# Altium schematic sheet v1.0.SchDoc
size 109 x 76 mm
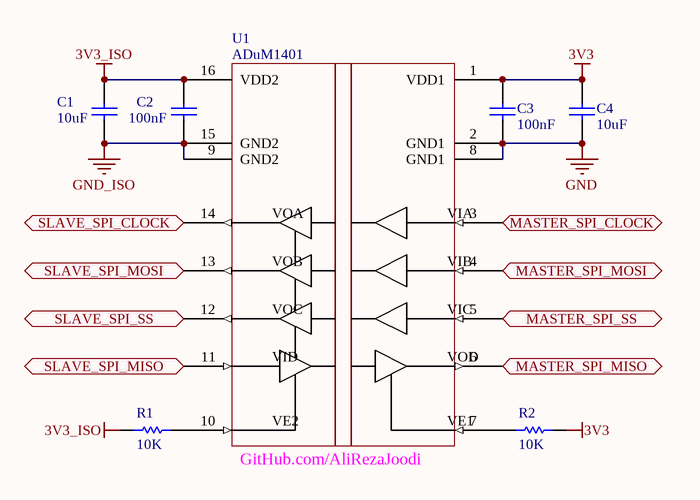
[diagram p0: v1.0.SchDoc]

## Parts
C1  10uF  [SMD_0805]
C2  100nF  [SMD_0805]
C3  100nF  [SMD_0805]
C4  10uF  [SMD_0805]
R1  10K  [SMD_0805]
R2  10K  [SMD_0805]
U1  ADuM1401  [SOIC127P1032X265-16N]

## Ports
MASTER_SPI_CLOCK (in), MASTER_SPI_MISO (out), MASTER_SPI_MOSI (in), MASTER_SPI_SS (in), SLAVE_SPI_CLOCK (out), SLAVE_SPI_MISO (in), SLAVE_SPI_MOSI (out), SLAVE_SPI_SS (out)

## Nets
3V3: C3.2 C4.1 R2.2 U1.1(VDD1)
3V3_ISO: C1.1 C2.2 R1.1 U1.16(VDD2)
GND: C3.1 C4.2 U1.2(GND1) U1.8(GND1)
GND_ISO: C1.2 C2.1 U1.9(GND2) U1.15(GND2)
MASTER_SPI_CLOCK: U1.3(VIA) ; port MASTER_SPI_CLOCK
MASTER_SPI_MISO: U1.6(VOD) ; port MASTER_SPI_MISO
MASTER_SPI_MOSI: U1.4(VIB) ; port MASTER_SPI_MOSI
MASTER_SPI_SS: U1.5(VIC) ; port MASTER_SPI_SS
SLAVE_SPI_CLOCK: U1.14(VOA) ; port SLAVE_SPI_CLOCK
SLAVE_SPI_MISO: U1.11(VID) ; port SLAVE_SPI_MISO
SLAVE_SPI_MOSI: U1.13(VOB) ; port SLAVE_SPI_MOSI
SLAVE_SPI_SS: U1.12(VOC) ; port SLAVE_SPI_SS
NetR1_2: R1.2 U1.10(VE2)
NetR2_1: R2.1 U1.7(VE1)

## Notes on the sheet
- (near U1) GitHub.com/AliRezaJoodi

## Library data of the parts
C1-C4 = Capacitor_Ceramic: Capacitor, Ceramic Multilayer; Revision: July-2002: Re-released for DXP Platform.
R1 R2 = Resistor: Resistor, 1/8W, 5%; Revision: July-2002: Re-released for DXP Platform.
U1 = ADuM1401BRW: IC, Quad-Channel Digital Isolators; 1_Manufacturer: Analog Devices; 1_Part Number: ADUM1401BRWZ; 1_Link: https://eu.mouser.com/ProductDetail/Analog-Devices/ADUM1401BRWZ?qs=WIvQP4zGangX4pUzjwuNkw%3D%3D